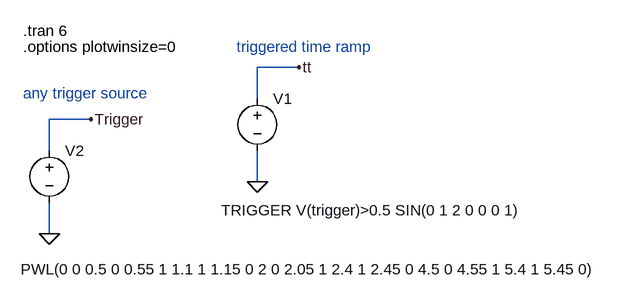
[diagram p0: schematic Fig_2-50_Trigger_SIN.asc]
Fig_2-50_Trigger_SIN.asc, the LTspice schematic file:
Version 4
SHEET 1 1312 680
WIRE -224 48 -288 48
WIRE -288 96 -288 48
WIRE -544 128 -608 128
WIRE -608 176 -608 128
WIRE -288 224 -288 176
WIRE -608 304 -608 256
FLAG -288 224 0
FLAG -608 304 0
FLAG -224 48 tt
FLAG -544 128 Trigger
SYMBOL voltage -288 80 R0
WINDOW 123 0 0 Left 2
WINDOW 39 0 0 Left 2
WINDOW 3 -56 188 Left 2
SYMATTR Value TRIGGER V(trigger)>0.5 SIN(0 1 2 0 0 0 1)
SYMATTR InstName V1
SYMBOL voltage -608 160 R0
WINDOW 123 0 0 Left 2
WINDOW 39 0 0 Left 2
WINDOW 3 -44 199 Left 2
SYMATTR Value PWL(0 0 0.5 0 0.55 1 1.1 1 1.15 0 2 0 2.05 1 2.4 1 2.45 0 4.5 0 4.55 1 5.4 1 5.45 0)
SYMATTR InstName V2
TEXT -648 -8 Left 2 !.tran 6
TEXT -648 16 Left 2 !.options plotwinsize=0
TEXT -320 16 Left 2 ;triggered time ramp
TEXT -648 88 Left 2 ;any trigger source

The netlist it stands for:
* Fig_2-50_Trigger_SIN.asc
V1 tt 0 TRIGGER V(trigger)>0.5 SIN(0 1 2 0 0 0 1)
V2 Trigger 0 PWL(0 0 0.5 0 0.55 1 1.1 1 1.15 0 2 0 2.05 1 2.4 1 2.45 0 4.5 0 4.55 1 5.4 1 5.45 0)
.tran 6
.options plotwinsize=0
* triggered time ramp
* any trigger source
.backanno
.end